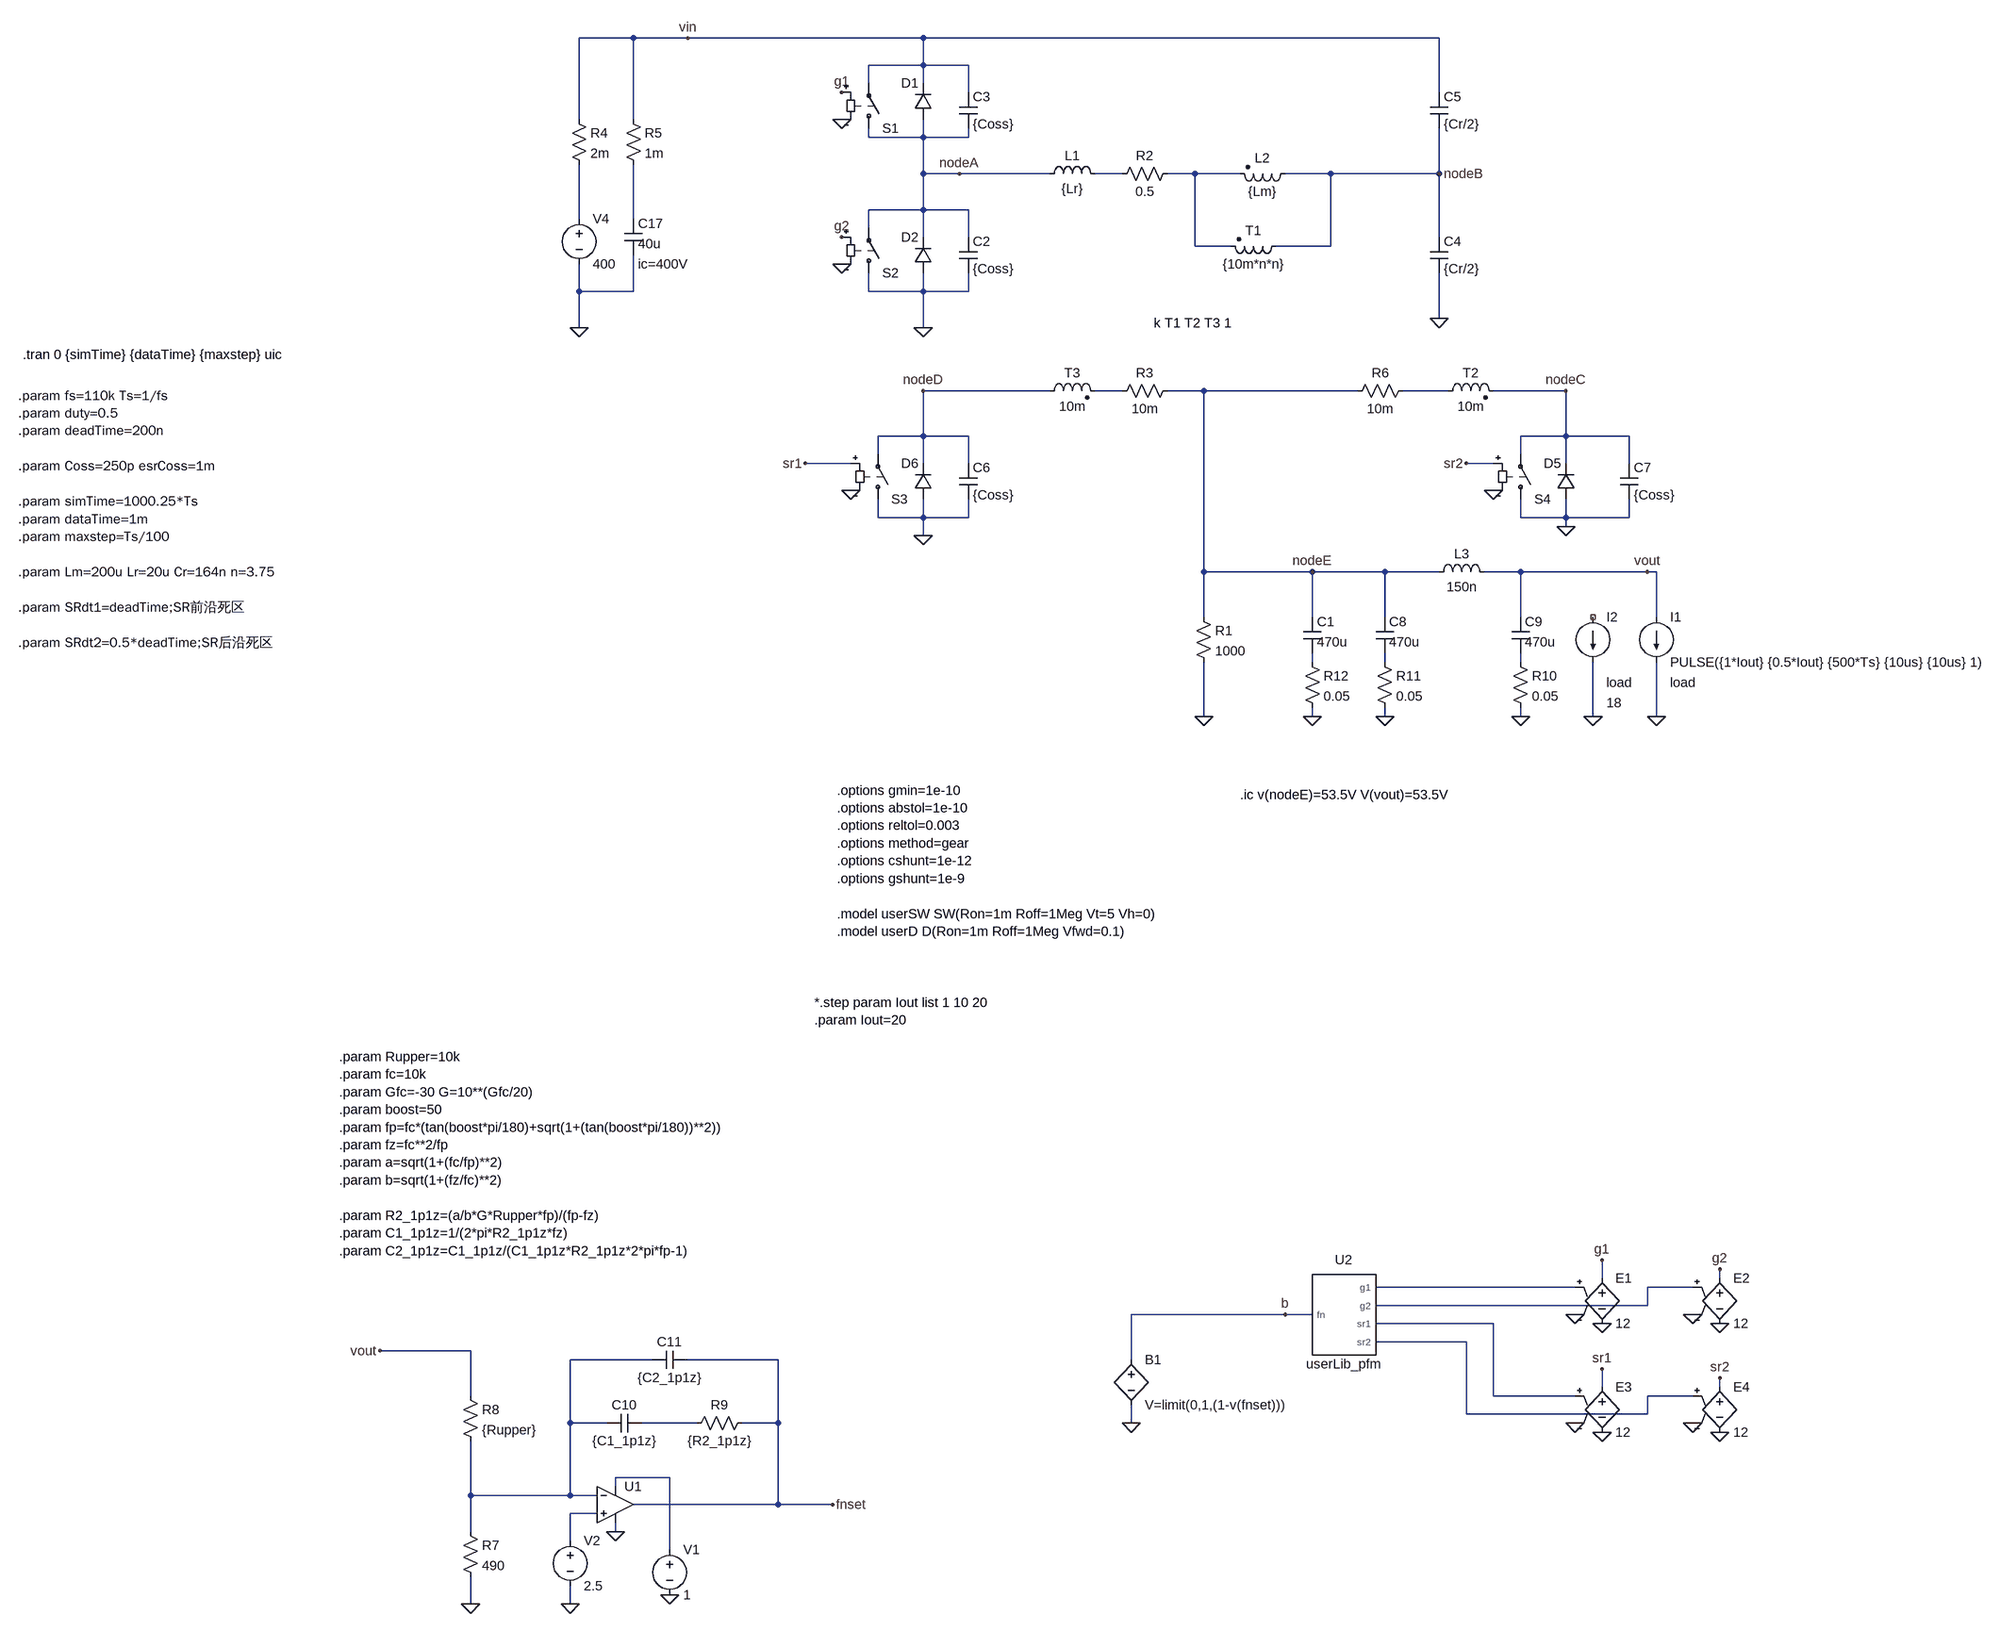
[diagram p0: schematic LLC_universal.asc]
LLC_universal.asc, the LTspice schematic file:
Version 4.1
SHEET 1 3076 3708
WIRE -1136 864 -1232 864
WIRE -1040 864 -1136 864
WIRE -624 864 -1040 864
WIRE 288 864 -624 864
WIRE -624 912 -624 864
WIRE -624 912 -720 912
WIRE -544 912 -624 912
WIRE -720 944 -720 912
WIRE -624 944 -624 912
WIRE -544 960 -544 912
WIRE 288 960 288 864
WIRE -1232 1008 -1232 864
WIRE -1136 1008 -1136 864
WIRE -720 1040 -720 1024
WIRE -624 1040 -624 1008
WIRE -624 1040 -720 1040
WIRE -544 1040 -544 1024
WIRE -544 1040 -624 1040
WIRE -624 1104 -624 1040
WIRE -560 1104 -624 1104
WIRE -400 1104 -560 1104
WIRE -272 1104 -320 1104
WIRE -144 1104 -192 1104
WIRE -64 1104 -144 1104
WIRE 96 1104 16 1104
WIRE 288 1104 288 1024
WIRE 288 1104 96 1104
WIRE -624 1168 -624 1104
WIRE -624 1168 -720 1168
WIRE -544 1168 -624 1168
WIRE -1232 1184 -1232 1088
WIRE -1136 1184 -1136 1088
WIRE -720 1200 -720 1168
WIRE -624 1216 -624 1168
WIRE -544 1216 -544 1168
WIRE 288 1216 288 1104
WIRE -144 1232 -144 1104
WIRE -80 1232 -144 1232
WIRE 96 1232 96 1104
WIRE 96 1232 0 1232
WIRE -1232 1312 -1232 1264
WIRE -1136 1312 -1136 1248
WIRE -1136 1312 -1232 1312
WIRE -720 1312 -720 1280
WIRE -624 1312 -624 1280
WIRE -624 1312 -720 1312
WIRE -544 1312 -544 1280
WIRE -544 1312 -624 1312
WIRE 288 1360 288 1280
WIRE -1232 1376 -1232 1312
WIRE -624 1376 -624 1312
WIRE -400 1488 -624 1488
WIRE -272 1488 -320 1488
WIRE -128 1488 -192 1488
WIRE 144 1488 -128 1488
WIRE 304 1488 224 1488
WIRE 512 1488 384 1488
WIRE -624 1568 -624 1488
WIRE -624 1568 -704 1568
WIRE -544 1568 -624 1568
WIRE 512 1568 512 1488
WIRE 512 1568 432 1568
WIRE 624 1568 512 1568
WIRE -704 1600 -704 1568
WIRE 432 1600 432 1568
WIRE -752 1616 -832 1616
WIRE -624 1616 -624 1568
WIRE -544 1616 -544 1568
WIRE 384 1616 336 1616
WIRE 512 1616 512 1568
WIRE 624 1616 624 1568
WIRE -704 1712 -704 1680
WIRE -624 1712 -624 1680
WIRE -624 1712 -704 1712
WIRE -544 1712 -544 1680
WIRE -544 1712 -624 1712
WIRE 432 1712 432 1680
WIRE 512 1712 512 1680
WIRE 512 1712 432 1712
WIRE 624 1712 624 1680
WIRE 624 1712 512 1712
WIRE 512 1728 512 1712
WIRE -624 1744 -624 1712
WIRE -128 1808 -128 1488
WIRE 64 1808 -128 1808
WIRE 192 1808 64 1808
WIRE 288 1808 192 1808
WIRE 432 1808 368 1808
WIRE 656 1808 432 1808
WIRE 672 1808 656 1808
WIRE -128 1888 -128 1808
WIRE 64 1888 64 1808
WIRE 192 1888 192 1808
WIRE 432 1888 432 1808
WIRE 672 1888 672 1808
WIRE 64 1968 64 1952
WIRE 192 1968 192 1952
WIRE 432 1968 432 1952
WIRE -128 2064 -128 1968
WIRE 64 2064 64 2048
WIRE 192 2064 192 2048
WIRE 432 2064 432 2048
WIRE 560 2064 560 1968
WIRE 672 2064 672 1968
WIRE 576 3104 576 3072
WIRE 784 3104 784 3088
WIRE 528 3120 176 3120
WIRE 736 3120 656 3120
WIRE 656 3152 656 3120
WIRE 656 3152 176 3152
WIRE 16 3168 -256 3168
WIRE 64 3168 16 3168
WIRE 384 3184 176 3184
WIRE 336 3216 176 3216
WIRE -1424 3232 -1584 3232
WIRE -1104 3248 -1248 3248
WIRE -880 3248 -1040 3248
WIRE -256 3248 -256 3168
WIRE 576 3296 576 3264
WIRE 784 3296 784 3280
WIRE -1424 3312 -1424 3232
WIRE 384 3312 384 3184
WIRE 528 3312 384 3312
WIRE 736 3312 656 3312
WIRE 336 3344 336 3216
WIRE 656 3344 656 3312
WIRE 656 3344 336 3344
WIRE -1248 3360 -1248 3248
WIRE -1184 3360 -1248 3360
WIRE -1024 3360 -1120 3360
WIRE -880 3360 -880 3248
WIRE -880 3360 -944 3360
WIRE -256 3360 -256 3328
WIRE -1072 3456 -1168 3456
WIRE -1168 3472 -1168 3456
WIRE -1424 3488 -1424 3392
WIRE -1248 3488 -1248 3360
WIRE -1248 3488 -1424 3488
WIRE -1200 3488 -1248 3488
WIRE -880 3504 -880 3360
WIRE -880 3504 -1136 3504
WIRE -784 3504 -880 3504
WIRE -1200 3520 -1248 3520
WIRE -1424 3552 -1424 3488
WIRE -1168 3552 -1168 3536
WIRE -1248 3568 -1248 3520
WIRE -1072 3584 -1072 3456
WIRE -1424 3680 -1424 3632
WIRE -1248 3680 -1248 3648
FLAG -624 1376 0
FLAG 64 2064 0
FLAG -128 2064 0
FLAG -560 1104 nodeA
FLAG -1232 1376 0
FLAG 512 1728 0
FLAG -624 1744 0
FLAG 656 1808 vout
FLAG -1040 864 vin
FLAG 672 2064 0
FLAG 512 1488 nodeC
FLAG -624 1488 nodeD
FLAG 288 1360 0
FLAG -768 1008 0
FLAG -768 960 g1
FLAG -768 1264 0
FLAG -768 1216 g2
FLAG 288 1104 nodeB
FLAG -752 1664 0
FLAG 384 1664 0
FLAG 192 2064 0
FLAG 432 2064 0
FLAG 64 1808 nodeE
FLAG 528 3168 0
FLAG 576 3184 0
FLAG 576 3072 g1
FLAG 736 3168 0
FLAG 784 3184 0
FLAG 784 3088 g2
FLAG -256 3360 0
FLAG 16 3168 b
FLAG 560 2064 0
FLAG -1424 3680 0
FLAG -1248 3680 0
FLAG -1584 3232 vout
FLAG -784 3504 fnset
FLAG 528 3360 0
FLAG 576 3376 0
FLAG 576 3264 sr1
FLAG 736 3360 0
FLAG 784 3376 0
FLAG 784 3280 sr2
FLAG -832 1616 sr1
FLAG 336 1616 sr2
FLAG -1168 3552 0
FLAG -1072 3664 0
SYMBOL diode -608 1008 R180
WINDOW 0 24 64 Left 2
WINDOW 3 24 0 Invisible 2
SYMATTR InstName D1
SYMATTR Value userD
SYMBOL cap 48 1888 R0
WINDOW 3 24 44 Left 2
SYMATTR Value 470u
SYMATTR InstName C1
SYMBOL res -144 1872 R0
SYMATTR InstName R1
SYMATTR Value 1000
SYMBOL voltage -1232 1168 R0
SYMATTR InstName V4
SYMATTR Value 400
SYMBOL diode -608 1280 R180
WINDOW 0 24 64 Left 2
WINDOW 3 24 0 Invisible 2
SYMATTR InstName D2
SYMATTR Value userD
SYMBOL cap -560 960 R0
SYMATTR InstName C3
SYMATTR Value {Coss}
SYMATTR SpiceLine Rser={esrCoss}
SYMBOL ind -416 1120 R270
WINDOW 0 32 56 VTop 2
WINDOW 3 5 56 VBottom 2
SYMATTR InstName L1
SYMATTR Value {Lr}
SYMATTR SpiceLine Rser=1m
SYMBOL cap 272 960 R0
SYMATTR InstName C5
SYMATTR Value {Cr/2}
SYMBOL ind2 32 1088 R90
WINDOW 0 4 56 VBottom 2
WINDOW 3 32 56 VTop 2
SYMATTR InstName L2
SYMATTR Value {Lm}
SYMATTR Type ind
SYMBOL ind2 288 1504 R270
WINDOW 0 32 56 VTop 2
WINDOW 3 4 56 VBottom 2
SYMATTR InstName T2
SYMATTR Value 10m
SYMATTR SpiceLine Rser=1m
SYMATTR Type ind
SYMBOL ind2 -416 1504 R270
WINDOW 0 32 56 VTop 2
WINDOW 3 4 56 VBottom 2
SYMATTR InstName T3
SYMATTR Value 10m
SYMATTR SpiceLine Rser=1m
SYMATTR Type ind
SYMBOL diode 528 1680 R180
WINDOW 0 24 64 Left 2
WINDOW 3 24 0 Invisible 2
SYMATTR InstName D5
SYMATTR Value userD
SYMBOL diode -608 1680 R180
WINDOW 0 24 64 Left 2
WINDOW 3 24 0 Invisible 2
SYMATTR InstName D6
SYMATTR Value userD
SYMBOL ind2 16 1216 R90
WINDOW 0 4 56 VBottom 2
WINDOW 3 32 56 VTop 2
SYMATTR InstName T1
SYMATTR Value {10m*n*n}
SYMATTR Type ind
SYMBOL current 672 1888 R0
WINDOW 39 24 116 Left 2
SYMATTR SpiceLine load
SYMATTR InstName I1
SYMATTR Value PULSE({1*Iout} {0.5*Iout} {500*Ts} {10us} {10us} 1)
SYMBOL res -1248 992 R0
SYMATTR InstName R4
SYMATTR Value 2m
SYMBOL cap -1152 1184 R0
WINDOW 3 24 44 Left 2
WINDOW 39 24 80 Left 2
SYMATTR Value 40u
SYMATTR SpiceLine ic=400V
SYMATTR InstName C17
SYMBOL res -1152 992 R0
SYMATTR InstName R5
SYMATTR Value 1m
SYMBOL cap 272 1216 R0
SYMATTR InstName C4
SYMATTR Value {Cr/2}
SYMBOL cap -560 1216 R0
SYMATTR InstName C2
SYMATTR Value {Coss}
SYMATTR SpiceLine Rser={esrCoss}
SYMBOL cap -560 1616 R0
SYMATTR InstName C6
SYMATTR Value {Coss}
SYMATTR SpiceLine Rser={esrCoss}
SYMBOL cap 608 1616 R0
SYMATTR InstName C7
SYMATTR Value {Coss}
SYMATTR SpiceLine Rser={esrCoss}
SYMBOL res -176 1088 R90
WINDOW 0 0 56 VBottom 2
WINDOW 3 32 56 VTop 2
SYMATTR InstName R2
SYMATTR Value 0.5
SYMBOL res -288 1504 R270
WINDOW 0 32 56 VTop 2
WINDOW 3 0 56 VBottom 2
SYMATTR InstName R3
SYMATTR Value 10m
SYMBOL res 240 1472 R90
WINDOW 0 0 56 VBottom 2
WINDOW 3 32 56 VTop 2
SYMATTR InstName R6
SYMATTR Value 10m
SYMBOL sw -720 1040 M180
WINDOW 3 24 -20 Invisible 2
SYMATTR Value userSW
SYMATTR InstName S1
SYMBOL sw -720 1296 M180
WINDOW 3 24 96 Invisible 2
SYMATTR Value userSW
SYMATTR InstName S2
SYMBOL sw -704 1696 M180
WINDOW 3 24 -20 Invisible 2
SYMATTR Value userSW
SYMATTR InstName S3
SYMBOL sw 432 1696 M180
WINDOW 3 24 96 Invisible 2
SYMATTR Value userSW
SYMATTR InstName S4
SYMBOL cap 176 1888 R0
WINDOW 3 24 44 Left 2
SYMATTR Value 470u
SYMATTR InstName C8
SYMBOL ind 272 1824 R270
WINDOW 0 32 56 VTop 2
WINDOW 3 5 56 VBottom 2
SYMATTR InstName L3
SYMATTR Value 150n
SYMBOL cap 416 1888 R0
WINDOW 3 24 44 Left 2
SYMATTR Value 470u
SYMATTR InstName C9
SYMATTR SpiceLine Rser=0.1
SYMBOL e 576 3088 R0
SYMATTR InstName E1
SYMATTR Value 12
SYMBOL e 784 3088 R0
SYMATTR InstName E2
SYMATTR Value 12
SYMBOL current 560 1888 R0
WINDOW 3 24 152 Left 2
WINDOW 123 0 0 Left 0
WINDOW 39 24 116 Left 2
SYMATTR Value 18
SYMATTR SpiceLine load
SYMATTR InstName I2
SYMBOL userLib_pfm 112 3184 R0
WINDOW 39 8 80 Invisible 2
SYMATTR SpiceLine fmax=200k fmin=60k dtDutyMR=0.05 dtDutySR=0.4
SYMATTR InstName U2
SYMBOL voltage -1248 3552 R0
WINDOW 123 0 0 Left 0
WINDOW 39 0 0 Left 0
SYMATTR InstName V2
SYMATTR Value 2.5
SYMBOL res -1440 3536 R0
SYMATTR InstName R7
SYMATTR Value 490
SYMBOL res -1440 3296 R0
SYMATTR InstName R8
SYMATTR Value {Rupper}
SYMBOL cap -1120 3344 R90
WINDOW 0 0 32 VBottom 2
WINDOW 3 32 32 VTop 2
SYMATTR InstName C10
SYMATTR Value {C1_1p1z}
SYMBOL res -928 3344 R90
WINDOW 0 0 56 VBottom 2
WINDOW 3 32 56 VTop 2
SYMATTR InstName R9
SYMATTR Value {R2_1p1z}
SYMBOL cap -1040 3232 R90
WINDOW 0 0 32 VBottom 2
WINDOW 3 32 32 VTop 2
SYMATTR InstName C11
SYMATTR Value {C2_1p1z}
SYMBOL bv -256 3232 R0
SYMATTR InstName B1
SYMATTR Value V=limit(0,1,(1-v(fnset)))
SYMBOL res 416 1952 R0
SYMATTR InstName R10
SYMATTR Value 0.05
SYMBOL res 176 1952 R0
SYMATTR InstName R11
SYMATTR Value 0.05
SYMBOL res 48 1952 R0
SYMATTR InstName R12
SYMATTR Value 0.05
SYMBOL e 576 3280 R0
SYMATTR InstName E3
SYMATTR Value 12
SYMBOL e 784 3280 R0
SYMATTR InstName E4
SYMATTR Value 12
SYMBOL voltage -1072 3568 R0
WINDOW 123 0 0 Left 0
WINDOW 39 0 0 Left 0
SYMATTR InstName V1
SYMATTR Value 1
SYMBOL OpAmps\\UniversalOpAmp2 -1168 3504 R0
SYMATTR InstName U1
TEXT -2432 1496 Left 2 !.param fs=110k Ts=1/fs\n.param duty=0.5\n.param deadTime=200n\n \n.param Coss=250p esrCoss=1m\n \n.param simTime=1000.25*Ts\n.param dataTime=1m\n.param maxstep=Ts/100\n \n.param Lm=200u Lr=20u Cr=164n n=3.75\n \n.param SRdt1=deadTime;SR前沿死区\n \n.param SRdt2=0.5*deadTime;SR后沿死区
TEXT -2424 1424 Left 2 !.tran 0 {simTime} {dataTime} {maxstep} uic
TEXT -216 1368 Left 2 !k T1 T2 T3 1
TEXT -816 2616 Left 2 !*.step param Iout list 1 10 20\n.param Iout=20
TEXT -776 2216 Left 2 !.options gmin=1e-10\n.options abstol=1e-10\n.options reltol=0.003\n.options method=gear\n.options cshunt=1e-12\n.options gshunt=1e-9\n \n.model userSW SW(Ron=1m Roff=1Meg Vt=5 Vh=0)\n.model userD D(Ron=1m Roff=1Meg Vfwd=0.1)
TEXT -64 2224 Left 2 !.ic v(nodeE)=53.5V V(vout)=53.5V
TEXT -1656 2712 Left 2 !.param Rupper=10k\n.param fc=10k\n.param Gfc=-30 G=10**(Gfc/20)\n.param boost=50\n.param fp=fc*(tan(boost*pi/180)+sqrt(1+(tan(boost*pi/180))**2))\n.param fz=fc**2/fp\n.param a=sqrt(1+(fc/fp)**2)\n.param b=sqrt(1+(fz/fc)**2)\n \n.param R2_1p1z=(a/b*G*Rupper*fp)/(fp-fz)\n.param C1_1p1z=1/(2*pi*R2_1p1z*fz)\n.param C2_1p1z=C1_1p1z/(C1_1p1z*R2_1p1z*2*pi*fp-1)

The netlist it stands for:
* LLC_universal.asc
D1 nodeA vin userD
C1 nodeE N007 470u
R1 nodeE 0 1000
V4 N003 0 400
D2 0 nodeA userD
C3 vin nodeA {Coss} Rser={esrCoss}
L1 nodeA N001 {Lr} Rser=1m
C5 vin nodeB {Cr/2}
L2 nodeB N002 {Lm}
L§T2 N006 nodeC 10m Rser=1m
L§T3 nodeD N005 10m Rser=1m
D5 0 nodeC userD
D6 0 nodeD userD
L§T1 nodeB N002 {10m*n*n}
I1 vout 0 PULSE({1*Iout} {0.5*Iout} {500*Ts} {10us} {10us} 1) load
R4 vin N003 2m
C17 N004 0 40u ic=400V
R5 vin N004 1m
C4 nodeB 0 {Cr/2}
C2 nodeA 0 {Coss} Rser={esrCoss}
C6 nodeD 0 {Coss} Rser={esrCoss}
C7 nodeC 0 {Coss} Rser={esrCoss}
R2 N002 N001 0.5
R3 N005 nodeE 10m
R6 N006 nodeE 10m
S1 nodeA vin g1 0 userSW
S2 0 nodeA g2 0 userSW
S3 0 nodeD sr1 0 userSW
S4 0 nodeC sr2 0 userSW
C8 nodeE N008 470u
L3 nodeE vout 150n
C9 vout N009 470u Rser=0.1
E1 g1 0 N010 0 12
E2 g2 0 N011 0 12
I2 NC_01 0 18 load
X§U2 b N010 N011 N012 N013 userLib_pfm fmax=200k fmin=60k dtDutyMR=0.05 dtDutySR=0.4  ; pins fn g1 g2 sr1 sr2
V2 N017 0 2.5
R7 N014 0 490
R8 vout N014 {Rupper}
C10 N015 N014 {C1_1p1z}
R9 fnset N015 {R2_1p1z}
C11 fnset N014 {C2_1p1z}
B1 b 0 V=limit(0,1,(1-v(fnset)))
R10 N009 0 0.05
R11 N008 0 0.05
R12 N007 0 0.05
E3 sr1 0 N012 0 12
E4 sr2 0 N013 0 12
V1 N016 0 1
X§U1 N017 N014 N016 0 fnset level2 Avol=1Meg GBW=10Meg Slew=10Meg Ilimit=25m Rail=0 Vos=0 En=0 Enk=0 In=0 Ink=0 Rin=500Meg  ; pins In+ In- V+ V- OUT
.model D D
.lib standard.dio
.param fs=110k Ts=1/fs
.param duty=0.5
.param deadTime=200n
.param Coss=250p esrCoss=1m
.param simTime=1000.25*Ts
.param dataTime=1m
.param maxstep=Ts/100
.param Lm=200u Lr=20u Cr=164n n=3.75
.param SRdt1=deadTime;SR前沿死区
.param SRdt2=0.5*deadTime;SR后沿死区
.tran 0 {simTime} {dataTime} {maxstep} uic
k T1 T2 T3 1
*.step param Iout list 1 10 20
.param Iout=20
.options gmin=1e-10
.options abstol=1e-10
.options reltol=0.003
.options method=gear
.options cshunt=1e-12
.options gshunt=1e-9
.model userSW SW(Ron=1m Roff=1Meg Vt=5 Vh=0)
.model userD D(Ron=1m Roff=1Meg Vfwd=0.1)
.ic v(nodeE)=53.5V V(vout)=53.5V
.param Rupper=10k
.param fc=10k
.param Gfc=-30 G=10**(Gfc/20)
.param boost=50
.param fp=fc*(tan(boost*pi/180)+sqrt(1+(tan(boost*pi/180))**2))
.param fz=fc**2/fp
.param a=sqrt(1+(fc/fp)**2)
.param b=sqrt(1+(fz/fc)**2)
.param R2_1p1z=(a/b*G*Rupper*fp)/(fp-fz)
.param C1_1p1z=1/(2*pi*R2_1p1z*fz)
.param C2_1p1z=C1_1p1z/(C1_1p1z*R2_1p1z*2*pi*fp-1)
.lib userLib_pfm.sub
.lib UniversalOpAmp2.lib
.backanno
.end